# EAGLE design picoAva (EAGLE 6.1)
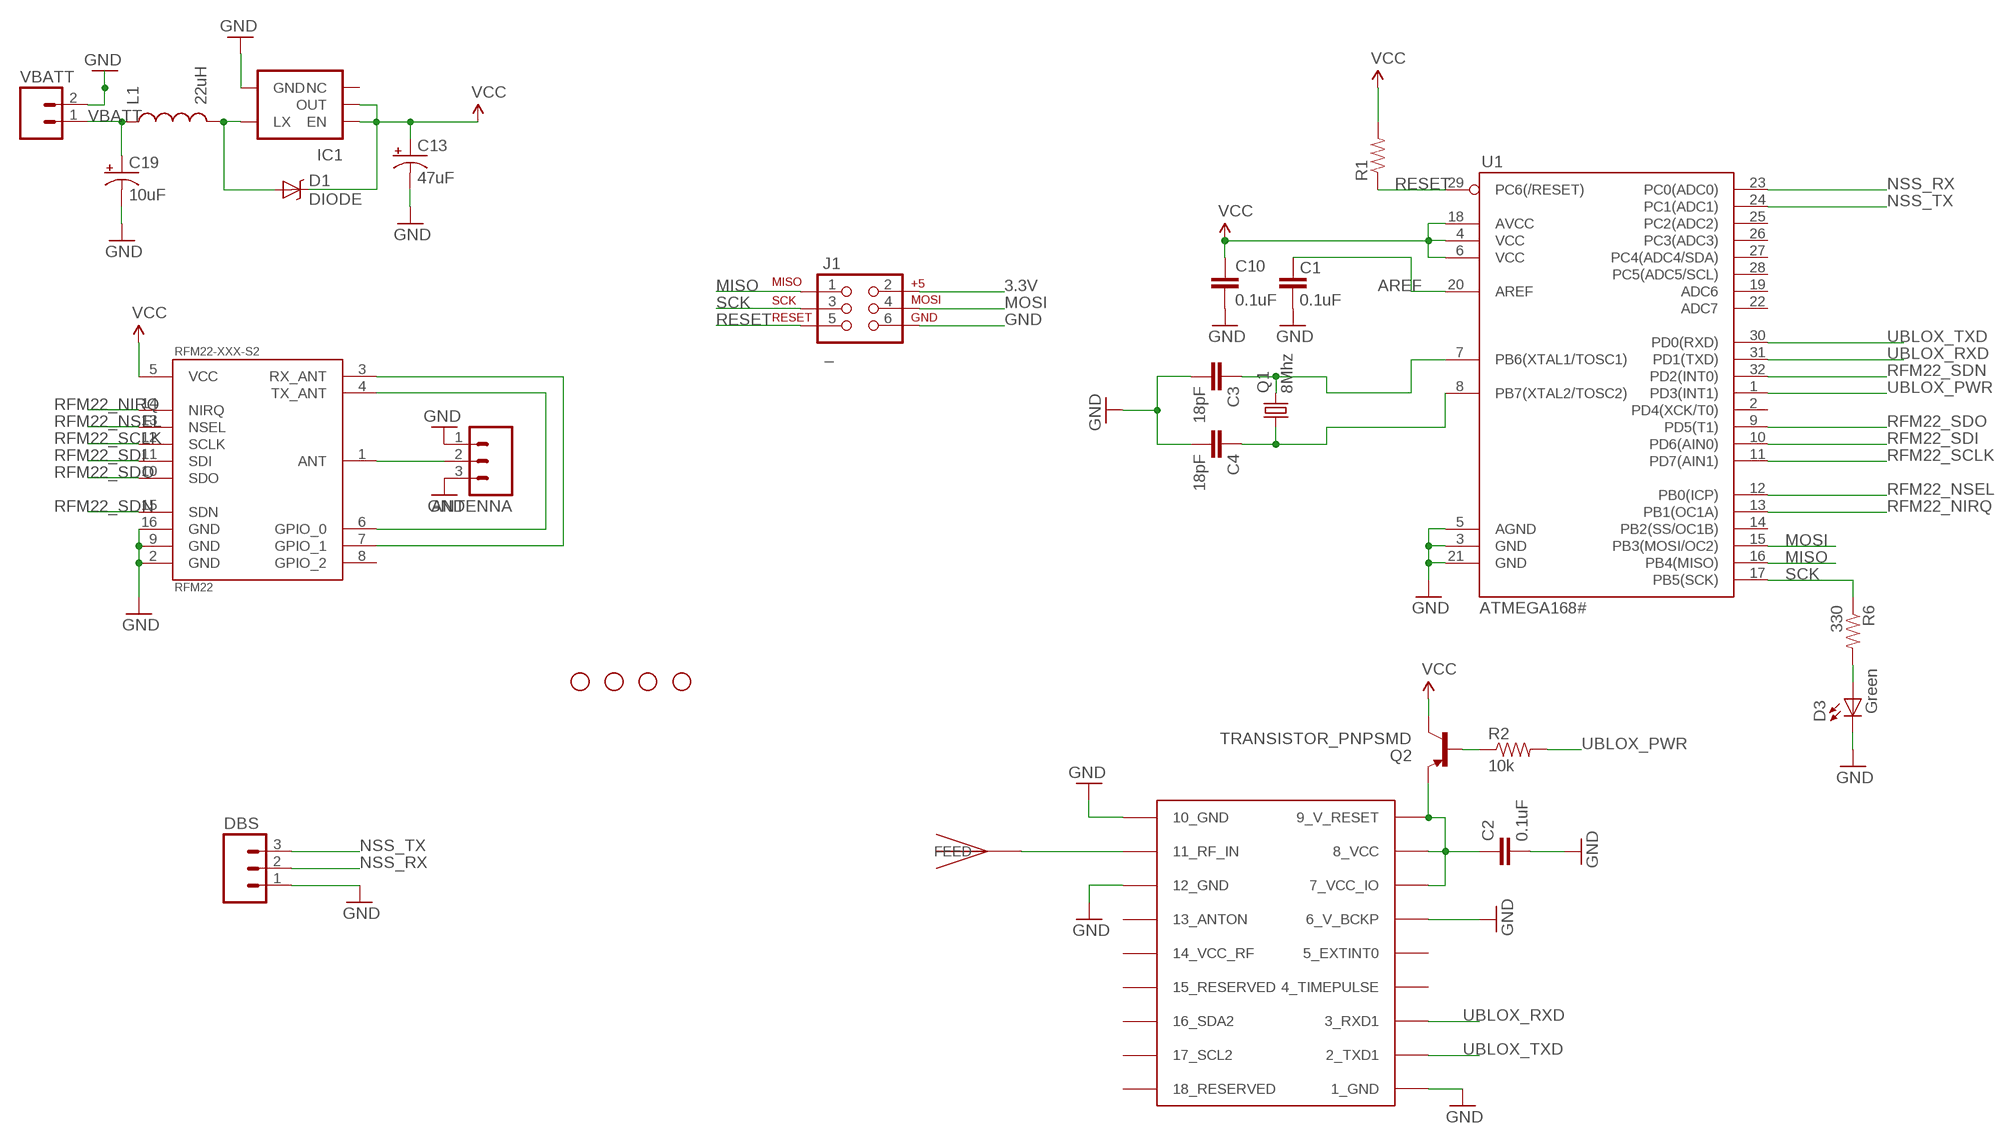
[diagram p0: schematic, sheet 1]

## Parts
ANTENNA  M03PTH  [1X03]
C1  0.1uF  CAP0603-CAP  [0603-CAP]
C2  0.1uF  CAP0603-CAP  [0603-CAP]
C3  18pF  C-EUC0805  [C0805]
C4  18pF  C-EUC0805  [C0805]
C10  0.1uF  CAP0603-CAP  [0603-CAP]
C13  47uF  CAP_POL1206  [EIA3216]
C19  10uF  CAP_POL1206  [EIA3216]
D1  DIODE  DIODE-SCHOTTKY_  [SMA-DIODE]
D3  Green  LED0603  [LED-0603]
DBS  M03PTH  [1X03]
IC1  V_REG_NCP1400SOT23-5  [SOT23-5]
J1  _  AVR_SPI_PRG_6NS  [2X3-NS]
JP1  STAND-OFF  [STAND-OFF]
JP2  STAND-OFF  [STAND-OFF]
JP3  STAND-OFF  [STAND-OFF]
JP4  STAND-OFF  [STAND-OFF]
L1  22uH  INDUCTOR1210  [1210]
Q1  8Mhz  CRYSTALSMD  [HC49UP]
Q2  TRANSISTOR_PNPSMD  [SOT23-3]
R1  RESISTOR0603-RES  [0603-RES]
R2  10k  RESISTOR0603-RES  [0603-RES]
R6  330  RESISTOR0603-RES  [0603-RES]
RFM22-XXX-S2  RFM22  [RFM22-XXX-S2]
U1  ATMEGA168#  ATMEGA168  [TQFP32-08]
U$1  UBLOX_MAX-6  [UBLOX_MAX-6]
U$3  JTI_ANTENNA-1575AT43A40  [JTI_ANTENNA-1575AT43A40]
VBATT  M02PTH  [1X02]

## Nets
3.3V: C10.1 C13.A(+) D1.C IC1.1(EN) IC1.2(OUT) J1.2 Q2.3(C) R1.2 RFM22-XXX-S2.5(VCC) U1.4(VCC) U1.6(VCC) U1.18(AVCC) ; supply symbol labelled VCC
AREF: C1.2 U1.20(AREF)
GND [vcc]: ANTENNA.1 ANTENNA.3 C1.1 C2.2 C3.2 C4.2 C10.2 C13.C(-) C19.C(-) D3.C DBS.1 IC1.4(GND) J1.6 RFM22-XXX-S2.2(GND) RFM22-XXX-S2.9(GND) RFM22-XXX-S2.16(GND) U1.3(GND) U1.5(AGND) U1.21(GND) U$1.1_GND U$1.6_V_BCKP U$1.10_GND U$1.12_GND VBATT.2
MISO: J1.1 U1.16(PB4(MISO))
MOSI: J1.4 U1.15(PB3(MOSI/OC2))
N$1: C3.1 Q1.2 U1.7(PB6(XTAL1/TOSC1))
N$2: C4.1 Q1.1 U1.8(PB7(XTAL2/TOSC2))
N$3: ANTENNA.2 RFM22-XXX-S2.1(ANT)
N$4: U$1.11_RF_IN U$3.FEED
N$5: RFM22-XXX-S2.3(RX_ANT) RFM22-XXX-S2.7(GPIO_1)
N$6: RFM22-XXX-S2.4(TX_ANT) RFM22-XXX-S2.6(GPIO_0)
N$7: D3.A R6.2
N$8: Q2.1(B) R2.1
N$11: D1.A IC1.5(LX) L1.2
NSS_RX: DBS.2 U1.23(PC0(ADC0))
NSS_TX: DBS.3 U1.24(PC1(ADC1))
RESET: J1.5 R1.1 U1.29(PC6(/RESET))
RFM22_NIRQ: RFM22-XXX-S2.14(NIRQ) U1.13(PB1(OC1A))
RFM22_NSEL: RFM22-XXX-S2.13(NSEL) U1.12(PB0(ICP))
RFM22_SCLK: RFM22-XXX-S2.12(SCLK) U1.11(PD7(AIN1))
RFM22_SDI: RFM22-XXX-S2.11(SDI) U1.10(PD6(AIN0))
RFM22_SDN: RFM22-XXX-S2.15(SDN) U1.32(PD2(INT0))
RFM22_SDO: RFM22-XXX-S2.10(SDO) U1.9(PD5(T1))
SCK: J1.3 R6.1 U1.17(PB5(SCK))
UBLOX_PWR: R2.2 U1.1(PD3(INT1))
UBLOX_RXD: U1.31(PD1(TXD)) U$1.3_RXD1
UBLOX_TXD: U1.30(PD0(RXD)) U$1.2_TXD1
VBATT [vcc]: C19.A(+) L1.1 VBATT.1
VCC: C2.1 Q2.2(E) U$1.7_VCC_IO U$1.8_VCC U$1.9_V_RESET
Unconnected: IC1.3(NC) RFM22-XXX-S2.8(GPIO_2) U1.2(PD4(XCK/T0)) U1.14(PB2(SS/OC1B)) U1.19(ADC6) U1.22(ADC7) U1.25(PC2(ADC2)) U1.26(PC3(ADC3)) U1.27(PC4(ADC4/SDA)) U1.28(PC5(ADC5/SCL)) U$1.4_TIMEPULSE U$1.5_EXTINT0 U$1.13_ANTON U$1.14_VCC_RF U$1.15_RESERVED U$1.16_SDA2 U$1.17_SCL2 U$1.18_RESERVED

## Library data of the parts
ANTENNA DBS = SparkFun:M03: Header 3 Standard 3-pin 0.1" header. Use with straight break away headers (SKU : PRT-00116), right angle break away headers (PRT-00553), swiss pins (PRT-00743), machine pins (PRT-00117), and female headers (PRT-00115). Molex polarized connector foot print use with SKU : PRT-08232 with associated crimp pins and housings.
C1 C2 C10 = SparkFun:CAP: Capacitor Standard 0603 ceramic capacitor, and 0.1" leaded capacitor.
C3 C4 = resistor:C-EU: CAPACITOR, European symbol
C13 C19 = SparkFun:CAP_POL: Capacitor Polarized These are standard SMD and PTH capacitors. Normally 10uF, 47uF, and 100uF in electrolytic and tantalum varieties. Always verify the external diameter of the through hole cap, it varies with capacity, voltage, and manufacturer. The EIA devices should be standard.
D1 = SparkFun:DIODE-SCHOTTKY
D3 = SparkFun:LED: LEDs Standard schematic elements and footprints for 5mm, 3mm, 1206, and 0603 sized LEDs. 5mm - Spark Fun Electronics SKU : COM-00529 (and others)
IC1 = SparkFun:V_REG_NCP1400: Switching step-up voltage regulator NCP1400 switiching regulator takes single cell AA and outputs 100mA at 3.3V or 5V with minimal number of external components.
J1 = SparkFun:AVR_SPI_PRG_6: AVR ISP 6 Pin This is the reduced ISP connector for AVR programming. Common on Arduino. This footprint will take up less PCB space and can be used with a 10-pin to 6-pin adapter such as SKU: BOB-08508
JP1-JP4 = SparkFun:STAND-OFF: Stand Off This is the mechanical footprint for a #4 phillips button head screw. Use the keepout ring to avoid running the screw head into surrounding components. SKU : PRT-00447
L1 = SparkFun:INDUCTOR: Inductors Basic Inductor/Choke - 0603 and 1206. Footprints are not proven and vary greatly between part numbers.
Q1 = SparkFun:CRYSTAL: Crystals Various standard crystals. Proven footprints. Spark Fun Electronics SKU : COM-00534
Q2 = SparkFun:TRANSISTOR_PNP
R1 R2 R6 = SparkFun:RESISTOR: Resistor Basic schematic elements and footprints for 0603, 1206, and PTH resistors.
RFM22-XXX-S2 = SparkFun:RFM22: *Hope RF's RFM22* Packages: RFM22-S2 (SMD)
U1 = SparkFun:ATMEGA168
U$1 = ava:UBLOX_MAX-6: UBLOX MAX-6
U$3 = ava:JTI_ANTENNA-1575AT43A40
VBATT = SparkFun:M02: Header 2 Standard 2-pin 0.1" header. Use with straight break away headers (SKU : PRT-00116), right angle break away headers (PRT-00553), swiss pins (PRT-00743), machine pins (PRT-00117), and female headers (PRT-00115). Molex polarized connector foot print use with SKU : PRT-08233 with associated crimp pins and housings.

## Net classes
0 default: width 0.203 mm
1 vcc: width 0.254 mm

## Board
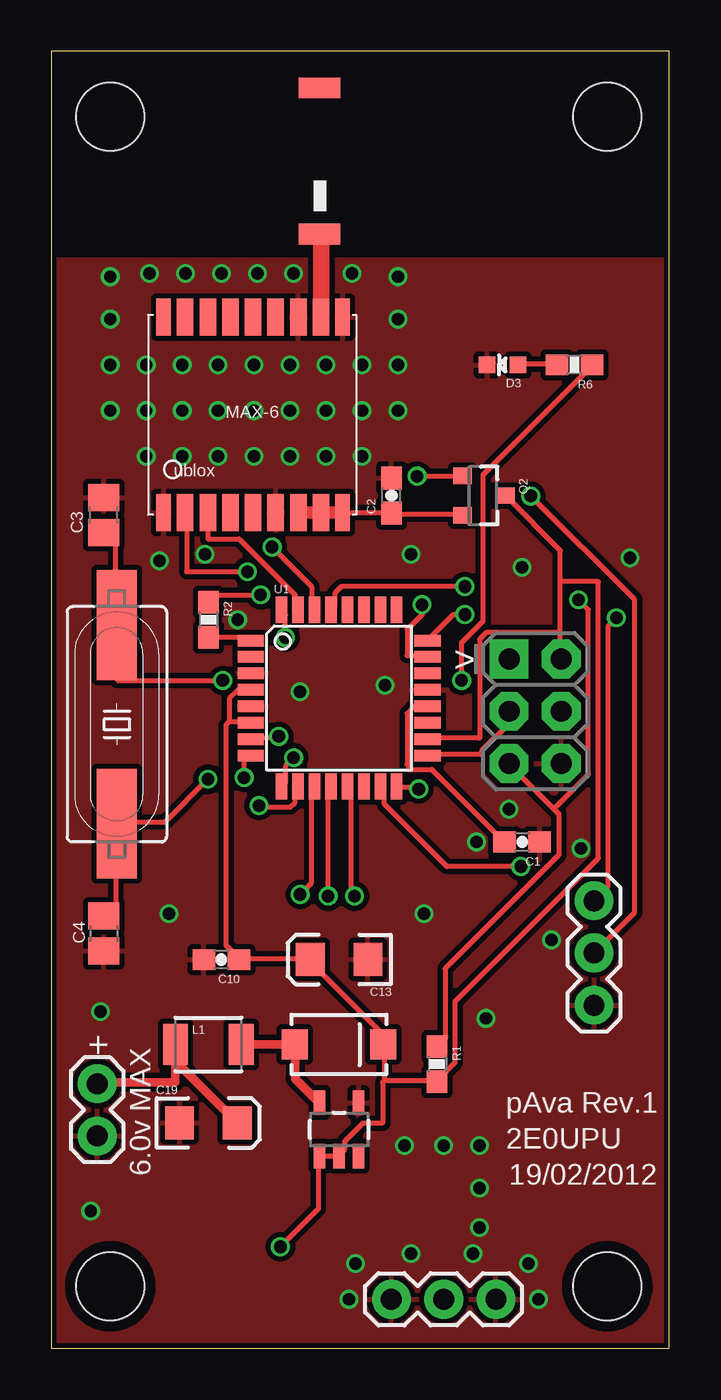
[diagram p1: board, top side]
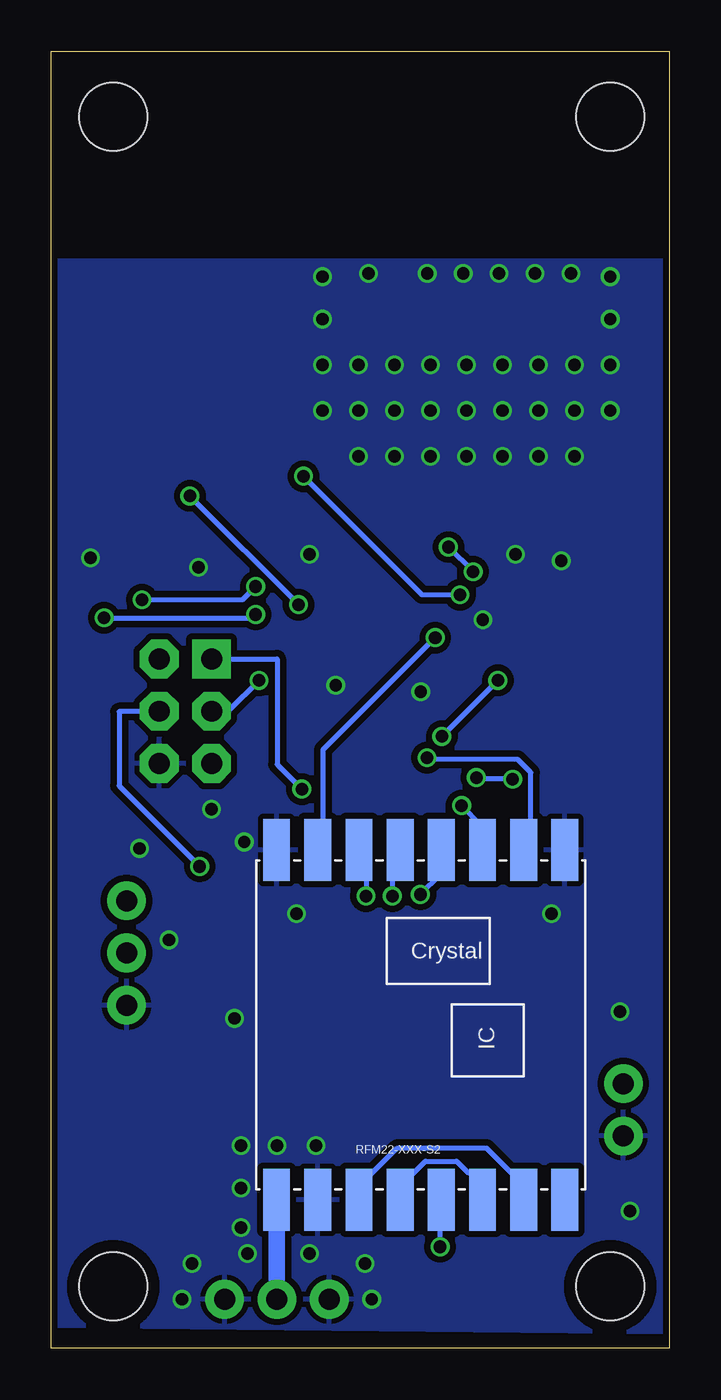
[diagram p2: board, bottom side, seen from below]

Size 30 x 63 mm. Coordinates in mm from the lower left corner, seen from the top.
Outline: 0,0 30,0 30,63 0,63 0,0
Copper layers (1*16): Top 0.035mm / dielectric 1.5mm / Bottom 0.035mm
Design rules: minimum track width 6mil, minimum drill 12mil, track to track 6mil, track to pad 6mil, pad to pad 6mil, via to via 6mil, smd to smd 0mil, copper to edge 10mil, drill to drill 10mil, minimum pad ring 10mil, minimum via ring 6mil, stop-mask expansion 2mil, vias tented up to drill 100mil, thermal gap 10mil
tRestrict: area 0,53.2 to 30.2,55.7
bRestrict: area 0,53.2 to 30.2,55.7

### Footprints (pad centres in the part's own frame; a part is rotated, then mirrored left to right if it is on the bottom)
1X03 = drill 1.016 pad 1.88: 1 0,0; 2 2.54,0; 3 5.08,0
0603-CAP = smd 1.1 x 1: 1 -0.85,0; 2 0.85,0
C0805 = smd 1.3 x 1.5: 1 -0.85,0; 2 0.85,0
EIA3216 = smd 1.4 x 1.6: A 1.4,0; C -1.4,0
SMA-DIODE = smd 1.27 x 1.47: A -2.15,0; C 2.15,0
LED-0603 = smd 0.8 x 0.8: A 0,-0.75; C 0,0.75
SOT23-5 = smd 0.55 x 1.2: 1 -0.95,-1.3; 2 0,-1.3; 3 0.95,-1.3; 4 0.95,1.3; 5 -0.95,1.3
2X3-NS = drill 1.016 pad 1.88 square: 1 -2.54,-1.27 | drill 1.016 pad 1.88 octagon: 2 -2.54,1.27; 3 0,-1.27; 4 0,1.27; 5 2.54,-1.27; 6 2.54,1.27
STAND-OFF = hole 3.302: 0,0
1210 = smd 1.2 x 2: 1 -1.6,0; 2 1.6,0
HC49UP = smd 5.334 x 1.93: 1 -4.826,0; 2 4.826,0
SOT23-3 = smd 0.8 x 0.9: 1 -0.95,-1; 2 0.95,-1; 3 0,1.1
0603-RES = smd 1.1 x 1: 1 -0.85,0; 2 0.85,0
RFM22-XXX-S2 = smd 3 x 1.3: 1 -8.5,7; 2 -8.5,5; 3 -8.5,3; 4 -8.5,1; 5 -8.5,-1; 6 -8.5,-3; 7 -8.5,-5; 8 -8.5,-7; 9 8.5,-7; 10 8.5,-5; 11 8.5,-3; 12 8.5,-1; 13 8.5,1; 14 8.5,3; 15 8.5,5; 16 8.5,7
TQFP32-08 = smd 1.27 x 0.559: 1 -4.293,2.8; 2 -4.293,2; 3 -4.293,1.2; 4 -4.293,0.4; 5 -4.293,-0.4; 6 -4.293,-1.2; 7 -4.293,-2; 8 -4.293,-2.8; 17 4.293,-2.8; 18 4.293,-2; 19 4.293,-1.2; 20 4.293,-0.4; 21 4.293,0.4; 22 4.293,1.2; 23 4.293,2; 24 4.293,2.8 | smd 0.559 x 1.27: 9 -2.8,-4.293; 10 -2,-4.293; 11 -1.2,-4.293; 12 -0.4,-4.293; 13 0.4,-4.293; 14 1.2,-4.293; 15 2,-4.293; 16 2.8,-4.293; 25 2.8,4.293; 26 2,4.293; 27 1.2,4.293; 28 0.4,4.293; 29 -0.4,4.293; 30 -1.2,4.293; 31 -2,4.293; 32 -2.8,4.293
UBLOX_MAX-6 = smd 1.8 x 0.7: 1_GND 4.95,-4.4; 9_V_RESET 4.95,4.3; 10_GND -4.55,4.3; 18_RESERVED -4.55,-4.4 | smd 1.8 x 0.8: 2_TXD1 4.95,-3.35; 3_RXD1 4.95,-2.25; 4_TIMEPULSE 4.95,-1.15; 5_EXTINT0 4.95,-0.05; 6_V_BCKP 4.95,1.05; 7_VCC_IO 4.95,2.15; 8_VCC 4.95,3.25; 11_RF_IN -4.55,3.25; 12_GND -4.55,2.15; 13_ANTON -4.55,1.05; 14_VCC_RF -4.55,-0.05; 15_RESERVED -4.55,-1.15; 16_SDA2 -4.55,-2.25; 17_SCL2 -4.55,-3.35
JTI_ANTENNA-1575AT43A40 = smd 1 x 2: FEED -3.81,-1.27; NC 3.29,-1.27
1X02 = drill 1.016 pad 1.88: 1 0,0; 2 2.54,0

### Placement (x,y rotation side)
ANTENNA  21.59,2.37 180 top
C1  22.86,24.59 180 top
C2  16.51,41.42 90 top
C3  2.54,40.47 90 top
C4  2.54,20.15 270 top
C10  8.26,18.88 180 top
C13  13.97,18.88 180 top
C19  7.62,10.94 0 top
D1  13.97,14.75 0 top
D3  21.91,47.77 90 top
DBS  26.35,16.66 90 top
IC1  13.97,10.62 0 top
J1  23.5,30.94 270 top
JP1  27,59.83 0 top
JP2  2.86,59.83 0 top
JP3  27,3 0 top
JP4  2.86,3 0 top
L1  7.62,14.75 0 top
Q1  3.17,30.31 90 top
Q2  20.95,41.42 270 top
R1  18.73,13.8 270 top
R2  7.62,35.39 270 top
R6  25.4,47.77 180 top
RFM22-XXX-S2  12.06,15.7 90 bottom
U1  13.97,31.58 0 top
U$1  9.84,45.55 270 top
U$3  11.75,57.93 90 top
VBATT  2.22,12.84 270 top

### Tracks (layer width: path | path; a pad name or v marks a point on that pad's centre or on a via)
3.3V  (via drill 0.61)
  Top 0.254: 24.72,34.76 24.72,33.56 J1.2 | 24.72,34.76 24.72,37.24 | 24.72,37.24 24.72,38.76 22.08,41.4 Q2.3 | 24.72,34.76 21.12,34.76 20.8,34.44 20.8,29.64 18.32,29.64 U1.18 | 8.64,30.44 9.6,30.44 U1.6 | 8.64,30.44 8.64,31.56 9.04,31.96 9.6,31.96 U1.4 | 8.64,30.44 8.48,30.28 8.48,19.56 9.04,19 C10.1 9.12,18.92 12.56,18.92 C13.A 12.56,18.76 16.08,15.24 16.08,14.84 D1.C 16.16,14.68 16.16,13 | 16.16,13 18.72,13 R1.2 18.8,13.08 19.6,13.88 19.6,16.84 26.56,23.8 26.56,37.24 24.72,37.24 | 16.16,13 16.08,12.92 16.08,10.92 15.12,10.92 14.24,10.04 14.24,9.64 14,9.4 IC1.2 13.92,9.32 13.04,9.32 IC1.1 12.96,9.24 12.96,6.76 v11.12,4.92
  Bottom 0.254: v11.12,4.92 11.12,7.16 RFM22-XXX-S2.5
AREF
  Top 0.254: C1.2 18.48,28.12 17.36,28.12 17.36,28.28 17.28,28.36 17.28,30.84 17.68,31.24 18.24,31.24 U1.20
GND  (via drill 0.6)
  other vias: 22.23,26.18 16.19,32.21 20.64,24.59 18.1,21.1 17.46,38.56 22.86,37.93 25.72,24.27 17.46,4.59 20.8,5.86 11.75,52.22 14.61,52.22 9.84,45.55 9.84,43.33 9.84,47.77 4.6,45.55 4.6,43.33 4.6,47.77 6.35,45.55 6.35,43.33 6.35,47.77 8.1,45.55 8.1,43.33 8.1,47.77 11.59,45.55 11.59,43.33 11.59,47.77 13.34,45.55 13.34,43.33 13.34,47.77 15.08,45.55 15.08,43.33 15.08,47.77 10,52.22 8.26,52.22 6.51,52.22 4.76,52.22 2.86,47.77 2.86,45.55 2.86,49.99 2.86,52.06 16.83,47.77 16.83,45.55 16.83,49.99 16.83,52.06 28.1,38.4 5.24,38.24 12.06,31.9 5.71,21.1 19.05,9.83 2.38,16.34 14.76,4.11 14.45,2.37 23.18,4.11 23.65,2.37 20.8,7.77 17.14,9.83 20.8,9.83 24.29,19.83 21.11,16.02 1.91,6.65 20.48,4.59 7.46,38.56 9.05,35.39
  pour Bottom (isolate 0.305): 0,1.1 0,52.85 0.32,53.17 24.13,53.48 29.84,53.48 29.84,1.41 30.16,1.1 0.32,0.78
  pour Top (isolate 0.254): 0,0.3 0,53.17 0.32,53.48 31,53.48 31,0.14 0.32,-0.01
MISO  (via drill 0.61)
  Top 0.254: v17.84,27.16 17.84,27.24 16.8,27.24 U1.16
  Bottom 0.254: v17.84,27.16 19.04,28.36 19.04,33.48 22.16,33.48 J1.1
MOSI  (via drill 0.61)
  Top 0.254: v22.8,23.4 19.2,23.4 16.16,26.44 16.16,27.08 16,27.24 U1.15
  Bottom 0.254: v22.8,23.4 26.72,27.32 26.72,30.92 24.8,30.92 J1.4
N$1  (via drill 0.61)
  Top 0.254: v11.04,29.72 11.04,29.64 9.68,29.64 U1.7 | v8.32,32.44 3.2,32.44 3.2,35.08 Q1.2 3.12,35.24 3.12,39 2.56,39.56 C3.1
  Bottom 0.254: v8.32,32.44 v11.04,29.72
N$2  (via drill 0.61)
  Top 0.254: v9.36,27.72 9.36,28.52 9.6,28.76 U1.8 | v7.6,27.64 5.52,25.56 3.2,25.56 Q1.1 3.12,25.4 3.12,21.56 2.56,21 C4.1
  Bottom 0.254: v9.36,27.72 9.28,27.64 v7.6,27.64
N$3
  Bottom 0.254: 19.07,3.34 19.05,3.32 | 19.07,3.64 19.12,3.64 ANTENNA.2
  Bottom 0.813: RFM22-XXX-S2.1 19.07,3.64 19.07,3.34
N$4
  Top 0.406: U$3.FEED 13.09,53.96
  Top 0.8: 13.09,53.96 U$1.11_RF_IN
N$5
  Bottom 0.254: RFM22-XXX-S2.7 7.12,7.24 7.12,8.52 7.68,8.52 8.88,9.72 13.2,9.72 15.04,7.88 15.04,7.24 RFM22-XXX-S2.3
N$6
  Bottom 0.254: RFM22-XXX-S2.6 9.12,7.24 9.12,8.52 9.76,8.52 10.32,9.08 11.84,9.08 13.04,7.88 13.04,7.24 RFM22-XXX-S2.4
N$7
  Top 0.254: D3.A 22.72,47.8 24.48,47.8 R6.2
N$8  (via drill 0.61)
  Top 0.254: v17.76,42.36 19.92,42.36 Q2.1 | v10.16,36.6 7.68,36.6 7.68,36.28 R2.1
  Bottom 0.254: v17.76,42.36 12,36.6 v10.16,36.6
N$11
  Top 0.254: 12.96,11.96 IC1.5 | 11.84,14.68 D1.A 11.76,14.76 | 9.28,14.76 L1.2
  Top 0.406: 12.96,11.96 11.84,13.08 11.84,14.68 | 11.76,14.76 9.28,14.76
NSS_RX  (via drill 0.61)
  Top 0.254: v18,36.12 18,35.64 17.28,34.92 17.28,33.64 18.24,33.64 U1.23 | v23.28,41.4 28.32,36.36 28.32,21.16 26.4,19.24 DBS.2
  Bottom 0.254: v23.28,41.4 v18,36.12
NSS_TX  (via drill 0.61)
  Top 0.254: v20.08,35.64 19.52,35.64 18.32,34.44 U1.24 | v27.44,35.48 27.04,35.08 27.04,22.44 26.4,21.8 DBS.3
  Bottom 0.254: v20.08,35.64 20.24,35.48 v27.44,35.48
RESET  (via drill 0.61)
  Top 0.254: 24.4,26.2 22.24,28.36 J1.5 | 24.4,26.2 24.64,25.96 24.64,23.96 19.12,18.44 19.12,15 18.8,14.68 R1.1 | v20.08,37 14.08,37 13.76,36.68 13.76,36.04 13.6,35.88 U1.29 | v25.6,36.36 26.08,35.88 26.08,27.88 24.4,26.2
  Bottom 0.254: v20.08,37 20.72,36.36 v25.6,36.36
RFM22_NIRQ  (via drill 0.61)
  Top 0.254: v14.72,21.96 14.56,22.12 14.56,27.08 14.4,27.24 U1.13
  Bottom 0.254: v14.72,21.96 14.72,24.2 15.04,24.2 RFM22-XXX-S2.14
RFM22_NSEL  (via drill 0.61)
  Top 0.254: v13.44,21.96 13.44,27.16 13.52,27.24 U1.12
  Bottom 0.254: v13.44,21.96 13.44,24.2 13.12,24.2 RFM22-XXX-S2.13
RFM22_SCLK  (via drill 0.61)
  Top 0.254: v12.08,22.04 12.64,22.6 12.64,27.16 12.72,27.24 U1.11
  Bottom 0.254: v12.08,22.04 11.12,23 11.12,24.2 RFM22-XXX-S2.12
RFM22_SDI  (via drill 0.61)
  Top 0.254: v10.08,26.36 10.08,26.28 11.6,26.28 11.84,26.52 11.84,27.16 11.92,27.24 U1.10
  Bottom 0.254: v10.08,26.36 9.12,25.4 9.12,24.28 RFM22-XXX-S2.11
RFM22_SDN  (via drill 0.61)
  Top 0.254: v11.36,34.52 11.36,35.64 11.2,35.8 U1.32
  Bottom 0.254: v11.36,34.52 16.8,29.08 16.8,24.28 17.04,24.28 RFM22-XXX-S2.15
RFM22_SDO  (via drill 0.61)
  Top 0.254: v11.76,28.68 11.36,28.28 11.36,27.48 11.2,27.32 U1.9
  Bottom 0.254: v11.76,28.68 11.68,28.6 7.36,28.6 6.72,27.96 6.72,24.28 7.04,24.28 RFM22-XXX-S2.10
SCK  (via drill 0.61)
  Top 0.254: v19.92,32.44 19.92,34.28 20.96,35.32 20.96,42.44 26.24,47.72 R6.1 | U1.17 18.32,28.84 20.88,28.84 20.88,29 22.16,30.28 22.16,30.92 J1.3
  Bottom 0.254: v19.92,32.44 21.36,31 22.16,31 J1.3
UBLOX_PWR
  Top 0.254: R2.2 7.68,34.52 9.6,34.52 9.6,34.44 U1.1
UBLOX_RXD
  Top 0.254: U1.31 11.92,35.88 11.84,35.96 11.84,36.6 9.12,39.32 7.6,39.32 7.6,40.52 U$1.3_RXD1
UBLOX_TXD  (via drill 0.61)
  Top 0.254: v10.72,38.92 12.64,37 12.64,35.96 12.72,35.88 U1.30 | v9.52,37.72 6.56,37.72 6.56,40.52 U$1.2_TXD1
  Bottom 0.254: v9.52,37.72 v10.72,38.92
VBATT
  Top 0.254: 6.08,13.88 6.08,14.68 L1.1 6,13.8 | 2.24,12.92 VBATT.1
  Top 0.406: 6.08,13.88 C19.A | 2.24,12.92 6,12.92 6,13.8
VCC
  Top 0.254: Q2.2 19.92,40.52 16.56,40.52 C2.1 16.4,40.6 14.24,40.6 U$1.9_V_RESET 14.08,40.6 | U$1.7_VCC_IO | 13.04,40.6 U$1.8_VCC 13.2,40.6
  Top 0.61: 13.04,40.6 U$1.7_VCC_IO | 13.2,40.6 14.08,40.6

### Text on the board
tPlace: > | 6.0v MAX | + | pAva Rev.1 | 2E0UPU | 19/02/2012